# EasyEDA schematic SCH_usb-hub_2024-05-01.json
TITLE: Sheet_1; REV: 1.0; Date: 2024-04-29; Sheet: 1/1; Drawn By: bsb21134; Company: Your Company
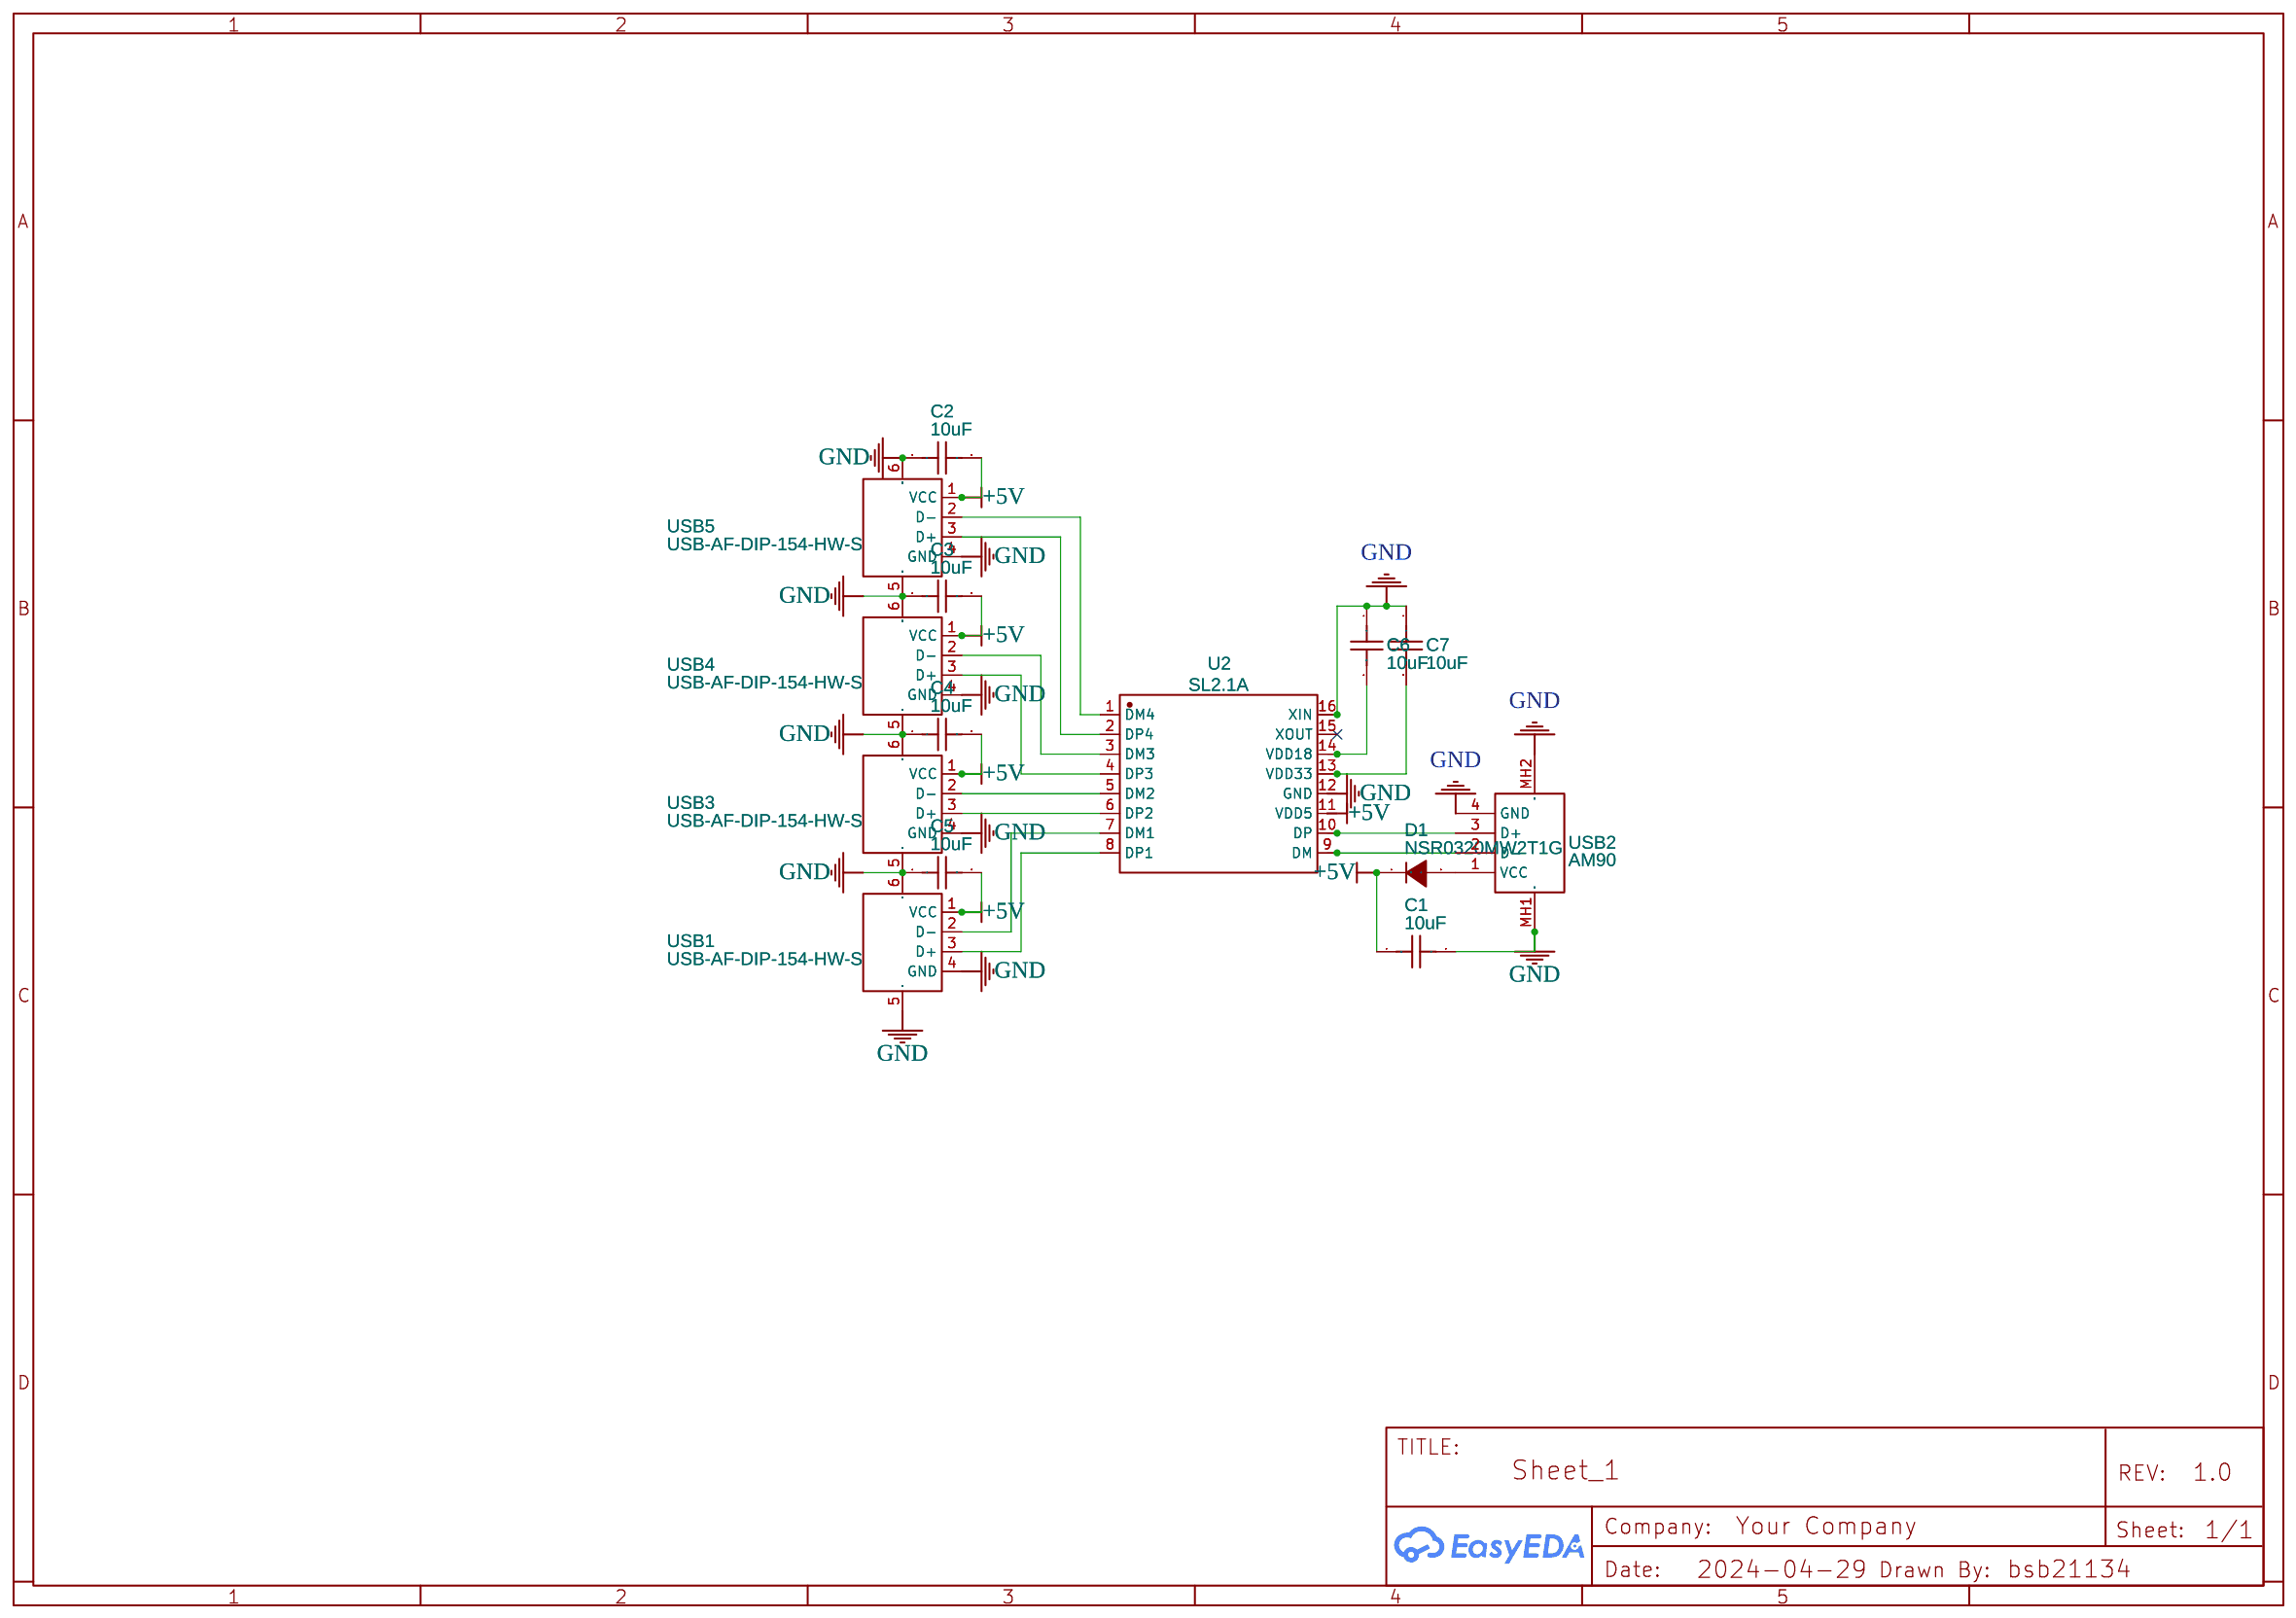
[diagram p0: schematic sheet]

## Parts
C1  10uF  [C0603]
C2  10uF  [C0603]
C3  10uF  [C0603]
C4  10uF  [C0603]
C5  10uF  [C0603]
C6  10uF  [C0603]
C7  10uF  [C0603]
D1  NSR0320MW2T1G  [SOD-323_L1.8-W1.3-LS2.5-RD]
U2  SL2.1A  [SOP-16_L10.0-W3.9-P1.27-LS6.0-BL]
USB1  USB-AF-DIP-154-HW-S  [USB-A-TH_USB-AF-DIP-154-HW-S]
USB2  AM90  [USB-AM-TH_AM90]
USB3  USB-AF-DIP-154-HW-S  [USB-A-TH_USB-AF-DIP-154-HW-S]
USB4  USB-AF-DIP-154-HW-S  [USB-A-TH_USB-AF-DIP-154-HW-S]
USB5  USB-AF-DIP-154-HW-S  [USB-A-TH_USB-AF-DIP-154-HW-S]

## Library data of the parts
C1-C7 = CL10A106KP8NNNC: Supplier: LCSC; Manufacturer: SAMSUNG(三星); Supplier Part: C19702; JLCPCB Part Class: Basic Part
D1 = NSR0320MW2T1G: Supplier: LCSC; Manufacturer: onsemi(安森美); Supplier Part: C48192; JLCPCB Part Class: Extended Part
U2 = SL2.1A: Contributor: LCSC; Supplier: LCSC; Supplier Part: C192893; Manufacturer: CoreChips(和芯润德); JLCPCB Part Class: Extended Part
USB1 USB3-USB5 = USB-AF-DIP-154-HW-S: Contributor: LCSC; Supplier: LCSC; Supplier Part: C2904892; Manufacturer: 皇捷; JLCPCB Part Class: Extended Part
USB2 = AM90: Contributor: LCSC; Supplier: LCSC; Supplier Part: C404965; Manufacturer: SHOU HAN(首韩); JLCPCB Part Class: Extended Part

## Nets
+5V: C1.1 C2.2 C3.2 C4.2 C5.2 D1.1(C) U2.11(VDD5) USB1.1(VCC) USB3.1(VCC) USB4.1(VCC) USB5.1(VCC)
GND: C1.2 C2.1 C3.1 C4.1 C5.1 C6.1 C7.1 U2.12(GND) U2.16(XIN) USB1.4(GND) USB1.5(SH1) USB1.6(SH2) USB2.4(GND) USB2.MH1 USB2.MH2 USB3.4(GND) USB3.5(SH1) USB3.6(SH2) USB4.4(GND) USB4.5(SH1) USB4.6(SH2) USB5.4(GND) USB5.5(SH1) USB5.6(SH2)
Net-(C6-2): C6.2 U2.14(VDD18)
Net-(C7-2): C7.2 U2.13(VDD33)
Net-(D1-2): D1.2(A) USB2.1(VCC)
Net-(U2-1): U2.1(DM4) USB5.2(D-)
Net-(U2-2): U2.2(DP4) USB5.3(D+)
Net-(U2-3): U2.3(DM3) USB4.2(D-)
Net-(U2-4): U2.4(DP3) USB4.3(D+)
Net-(U2-5): U2.5(DM2) USB3.2(D-)
Net-(U2-6): U2.6(DP2) USB3.3(D+)
Net-(U2-7): U2.7(DM1) USB1.2(D-)
Net-(U2-8): U2.8(DP1) USB1.3(D+)
Net-(U2-9): U2.9(DM) USB2.2(D-)
Net-(U2-10): U2.10(DP) USB2.3(D+)

Not connected (* = marked no-connect by the designer): U2 15(XOUT)*
